# EAGLE design schema (EAGLE 6.5.0)
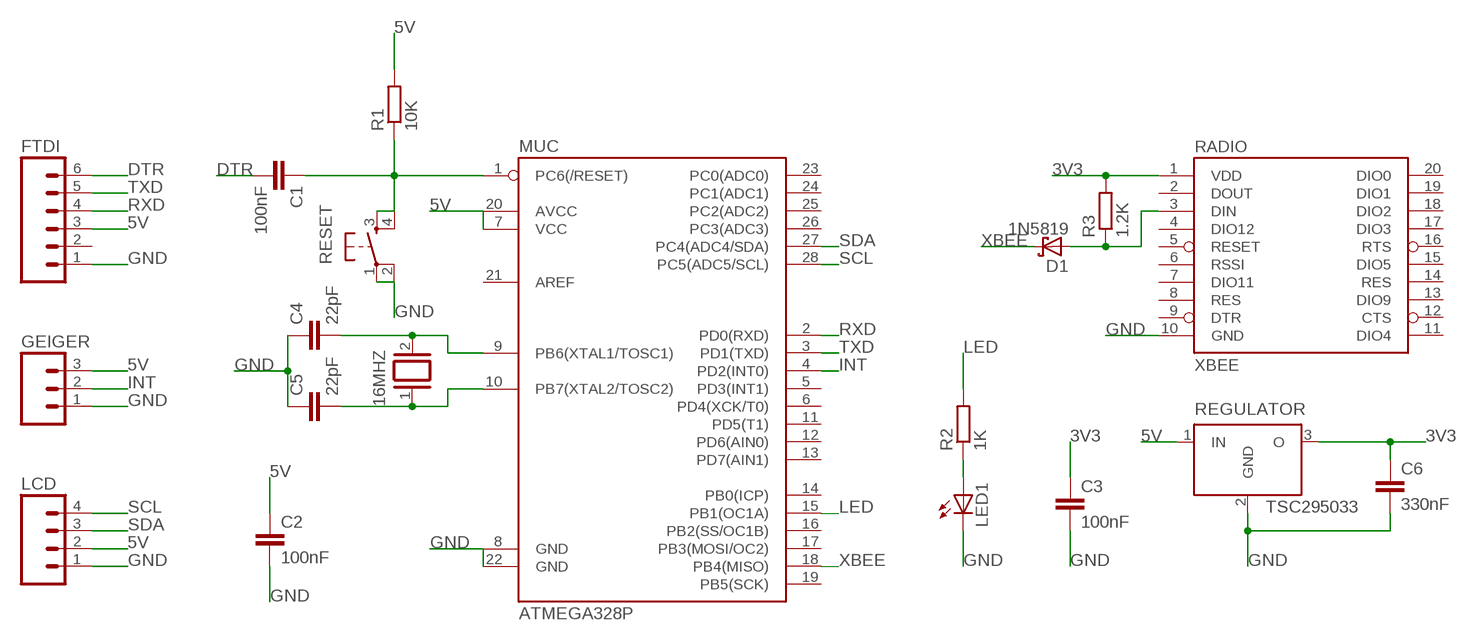
[diagram p0: schematic, sheet 1]

## Parts
16MHZ  XTAL/S  [QS]
C1  100nF  C-EU025-025X050  [C025-025X050]
C2  100nF  C-EU025-025X050  [C025-025X050]
C3  100nF  C-EU025-025X050  [C025-025X050]
C4  22pF  C-EU025-025X050  [C025-025X050]
C5  22pF  C-EU025-025X050  [C025-025X050]
C6  330nF  C-EU025-025X050  [C025-025X050]
D1  1N5819  1N5819-B  [DO41-7.6]
FTDI  M06SIP  [1X06]
GEIGER  M03PTH  [1X03]
LCD  M04PTH  [1X04]
LED1  LED3MM  [LED3MM]
MUC  ATMEGA328P  ATMEGA328P_PDIP  [DIL28-3]
R1  10K  R-EU_0207/10  [0207/10]
R2  1K  R-EU_0207/10  [0207/10]
R3  1.2K  R-EU_0207/10  [0207/10]
RADIO  XBEE  XBEE-1B1  [XBEE-1]
REGULATOR  TSC295033  LP2950Z  [TO92]
RESET  TAC_SWITCHPTH  [TACTILE-PTH]

## Nets
3V3: C3.1 C6.1 R3.2 RADIO.1(VDD) REGULATOR.3(O)
5V: C2.1 FTDI.3 GEIGER.3 LCD.2 MUC.7(VCC) MUC.20(AVCC) R1.2 REGULATOR.1(IN)
DTR: C1.2 FTDI.6
GND: C2.2 C3.2 C4.1 C5.1 C6.2 FTDI.1 GEIGER.1 LCD.1 LED1.K(C) MUC.8(GND) MUC.22(GND) RADIO.10(GND) REGULATOR.2(GND) RESET.1 RESET.2
INT: GEIGER.2 MUC.4(PD2(INT0))
LED: MUC.15(PB1(OC1A)) R2.2
N$1: C1.1 MUC.1(PC6(/RESET)) R1.1 RESET.3 RESET.4
N$2: 16MHZ.2 C4.2 MUC.9(PB6(XTAL1/TOSC1))
N$3: 16MHZ.1 C5.2 MUC.10(PB7(XTAL2/TOSC2))
N$4: D1.A R3.1 RADIO.3(DIN)
N$5: LED1.A R2.1
RXD: FTDI.4 MUC.2(PD0(RXD))
SCL: LCD.4 MUC.28(PC5(ADC5/SCL))
SDA: LCD.3 MUC.27(PC4(ADC4/SDA))
TXD: FTDI.5 MUC.3(PD1(TXD))
XBEE: D1.C MUC.18(PB4(MISO))
Unconnected: FTDI.2 MUC.5(PD3(INT1)) MUC.6(PD4(XCK/T0)) MUC.11(PD5(T1)) MUC.12(PD6(AIN0)) MUC.13(PD7(AIN1)) MUC.14(PB0(ICP)) MUC.16(PB2(SS/OC1B)) MUC.17(PB3(MOSI/OC2)) MUC.19(PB5(SCK)) MUC.21(AREF) MUC.23(PC0(ADC0)) MUC.24(PC1(ADC1)) MUC.25(PC2(ADC2)) MUC.26(PC3(ADC3)) RADIO.2(DOUT) RADIO.4(DIO12) RADIO.5(RESET) RADIO.6(RSSI) RADIO.7(DIO11) RADIO.8(RES) RADIO.9(DTR) RADIO.11(DIO4) RADIO.12(CTS) RADIO.13(DIO9) RADIO.14(RES) RADIO.15(DIO5) RADIO.16(RTS) RADIO.17(DIO3) RADIO.18(DIO2) RADIO.19(DIO1) RADIO.20(DIO0)

## Library data of the parts
16MHZ = special:XTAL/S: CRYSTAL
C1-C6 = rcl:C-EU: CAPACITOR, European symbol
D1 = diode:1N581*: 1.0A SCHOTTKY BARRIER RECTIFIER Source: http://www.diodes.com/datasheets/ds23001.pdf
FTDI = SparkFun-Connectors:M06: Header 6 Standard 6-pin 0.1" header. Use with straight break away headers (SKU : PRT-00116), right angle break away headers (PRT-00553), swiss pins (PRT-00743), machine pins (PRT-00117), and female headers (PRT-00115). Molex polarized connector foot print use with SKU : PRT-08094 with associated crimp pins and housings. NOTES ON THE VARIANTS LOCK and LOCK_LONGPADS... This footprint was designed to help hold the alignment of a through-hole component (i.e. 6-pin header) while soldering it into place. You may notice that each hole has been shifted either up or down by 0.005 of an inch from it's more standard position (which is a perfectly straight line). This slight alteration caused the pins (the squares in the middle) to touch the edges of the holes. Because they are alternating, it causes a "brace" to hold the component in place. 0.005 has proven to be the perfect amount of "off-center" position when using our standard breakaway headers. Although looks a little odd when you look at the bare footprint, once you have a header in there, the alteration is very hard to notice. Also, if you push a header all the way into place, it is covered up entirely on the bottom side. This idea of altering the position of holes to aid alignment will be further integrated into the Sparkfun Library for other footprints. It can help hold any component with 3 or more connection pins.
GEIGER = SparkFun-Connectors:M03: Header 3 Standard 3-pin 0.1" header. Use with straight break away headers (SKU : PRT-00116), right angle break away headers (PRT-00553), swiss pins (PRT-00743), machine pins (PRT-00117), and female headers (PRT-00115). Molex polarized connector foot print use with SKU : PRT-08232 with associated crimp pins and housings.
LCD = SparkFun-Connectors:M04: Header 4 Standard 4-pin 0.1" header. Use with straight break away headers (SKU : PRT-00116), right angle break away headers (PRT-00553), swiss pins (PRT-00743), machine pins (PRT-00117), and female headers (PRT-00115). Molex polarized connector foot print use with SKU : PRT-08231 with associated crimp pins and housings. 1MM SMD Version SKU: PRT-10208
LED1 = led:LED: LED OSRAM: - CHIPLED LG R971, LG N971, LY N971, LG Q971, LY Q971, LO R971, LY R971 LH N974, LH R974 LS Q976, LO Q976, LY Q976 LO Q996 - Hyper CHIPLED LW Q18S LB Q993, LB Q99A, LB R99A - SideLED LS A670, LO A670, LY A670, LG A670, LP A670 LB A673, LV A673, LT A673, LW A673 LH A674 LY A675 LS A676, LA A676, LO A676, LY A676, LW A676 LS A679, LY A679, LG A679 - Hyper Micro SIDELED® LS Y876, LA Y876, LO Y876, LY Y876 LT Y87S - SmartLED LW L88C, LW L88S LB L89C, LB L89S, LG L890 LS L89K, LO L89K, LY L89K LS L896, LA L896, LO L896, LY L896 - TOPLED LS T670, LO T670, LY T670, LG T670, LP T670 LSG T670, LSP T670, LSY T670, LOP T670, LYG T670 LG T671, LOG T671, LSG T671 LB T673, LV T673, LT T673, LW T673 LH T674 LS T676, LA T676, LO T676, LY T676, LB T676, LH T676, LSB T676, LW T676 LB T67C, LV T67C, LT T67C, LS T67K, LO T67K, LY T67K, LW E67C LS E67B, LA E67B, LO E67B, LY E67B, LB E67C, LV E67C, LT E67C LW T67C LS T679, LY T679, LG T679 LS T770, LO T770, LY T770, LG T770, LP T770 LB T773, LV T773, LT T773, LW T773 LH T774 LS E675, LA E675, LY E675, LS T675 LS T776, LA T776, LO T776, LY T776, LB T776 LHGB T686 LT T68C, LB T68C - Hyper Mini TOPLED® LB M676 - Mini TOPLED Santana® LG M470 LS M47K, LO M47K, LY M47K Source: http://www.osram.convergy.de LUXEON: - LUMILED® LXK2-PW12-R00, LXK2-PW12-S00, LXK2-PW14-U00, LXK2-PW14-V00 LXK2-PM12-R00, LXK2-PM12-S00, LXK2-PM14-U00 LXK2-PE12-Q00, LXK2-PE12-R00, LXK2-PE12-S00, LXK2-PE14-T00, LXK2-PE14-U00 LXK2-PB12-K00, LXK2-PB12-L00, LXK2-PB12-M00, LXK2-PB14-N00, LXK2-PB14-P00, LXK2-PB14-Q00 LXK2-PR12-L00, LXK2-PR12-M00, LXK2-PR14-Q00, LXK2-PR14-R00 LXK2-PD12-Q00, LXK2-PD12-R00, LXK2-PD12-S00 LXK2-PH12-R00, LXK2-PH12-S00 LXK2-PL12-P00, LXK2-PL12-Q00, LXK2-PL12-R00 Source: www.luxeon.com KINGBRIGHT: KA-3528ASYC Source: www.kingbright.com
MUC = SparkFun-DigitalIC:ATMEGA328P_PDIP: uC used in the Arduino 32kb flash, 1k EEPROM, 2k SRAM This is the through-hole version of this chip.
R1-R3 = resistor:R-EU_: RESISTOR, European symbol
RADIO = SparkFun-RF:XBEE-1: Xbee module footprints SMT header is CONN-09042.
REGULATOR = national-semiconductor:LP2950: Adjustable Micropower Voltage Regulator Source: http://www.national.com/ds/LP/LP2950.pdf; MF: NATIONAL SEMICONDUCTOR; MPN: LP2950CZ-5.0/NOPB; OC_FARNELL: 1150320; OC_NEWARK: 41K6545
RESET = SparkFun-Electromechanical:TAC_SWITCH: Momentary Switch Button commonly used for reset or general input. Spark Fun Electronics SKU : COM-00097

## Board
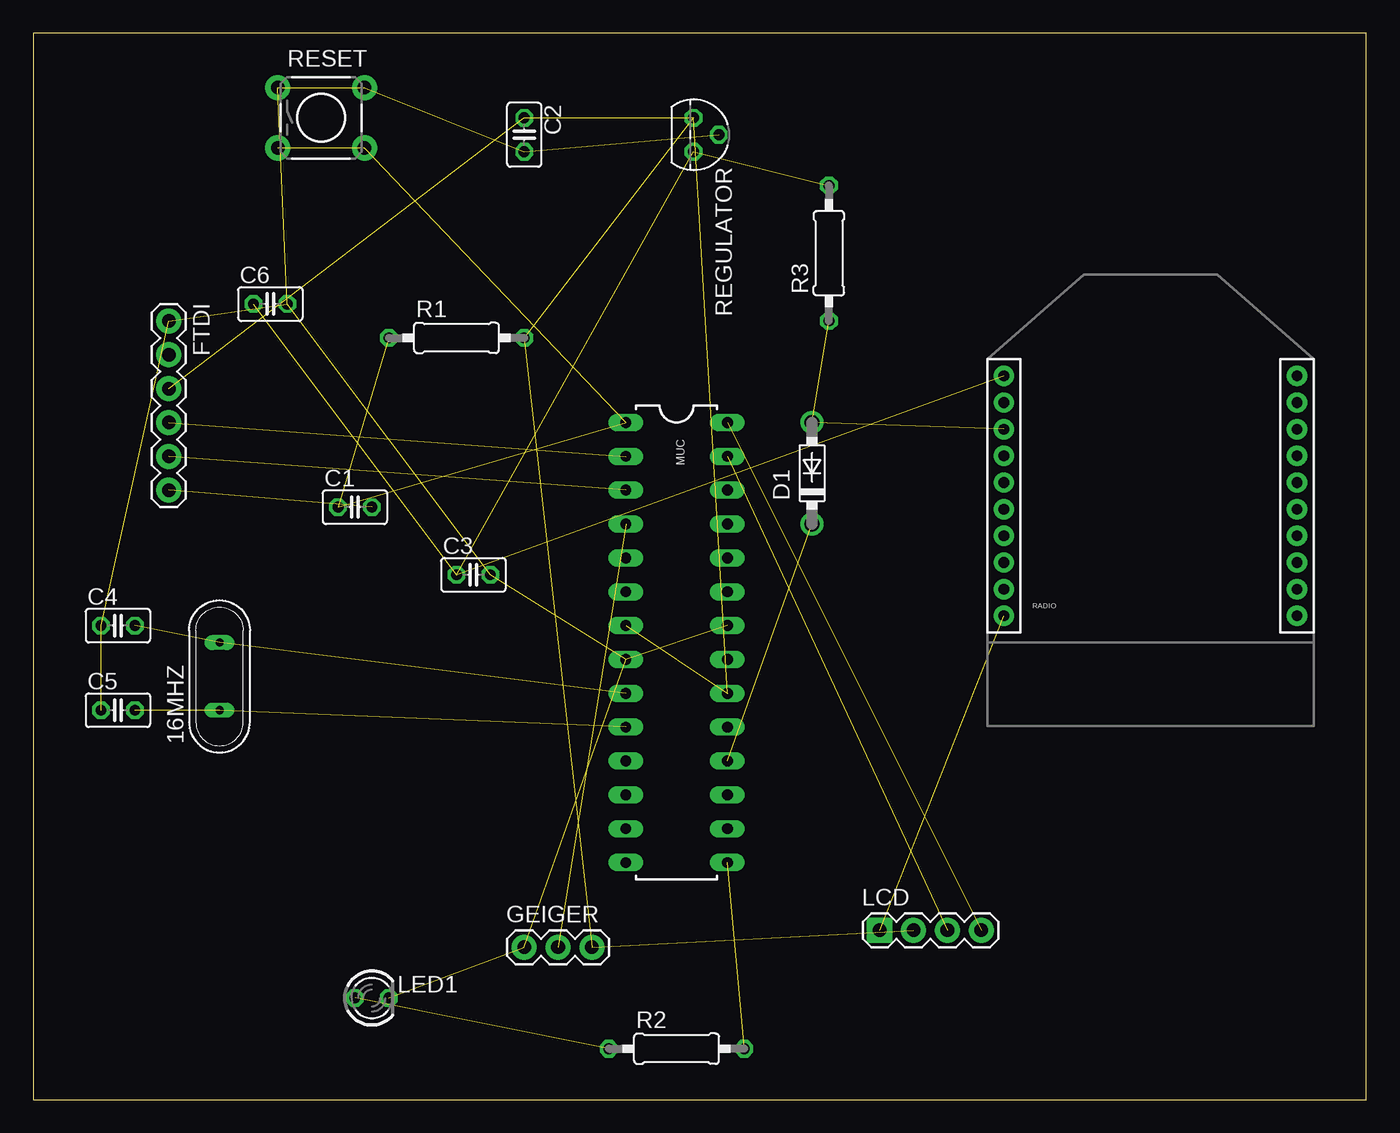
[diagram p1: board, top side]
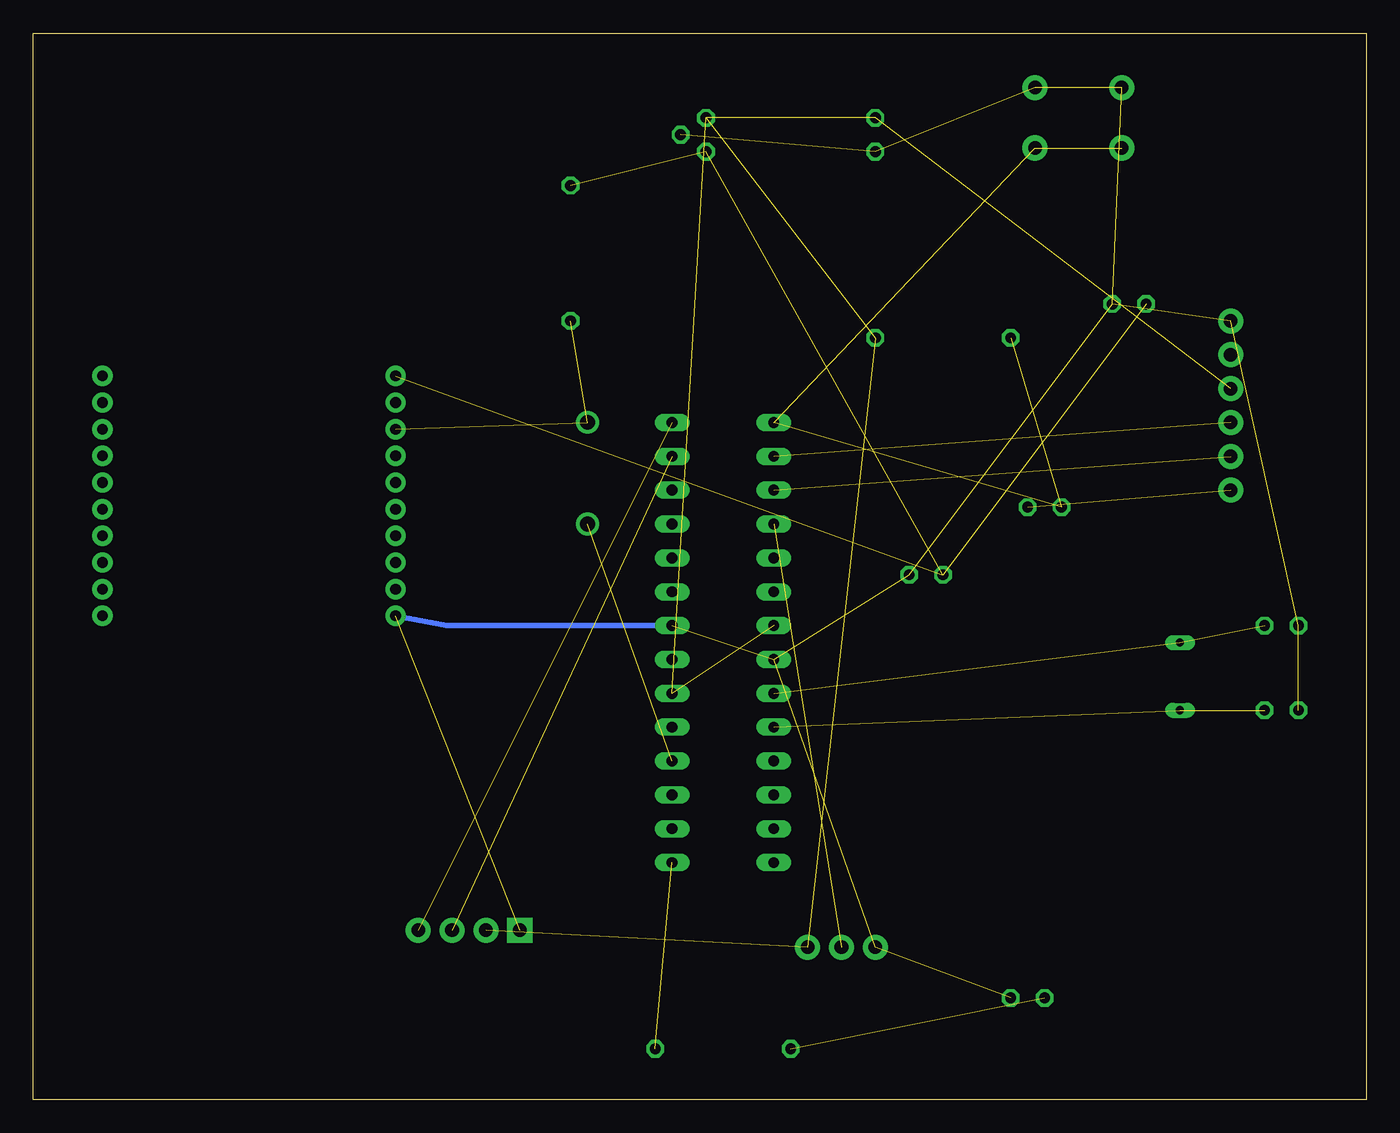
[diagram p2: board, bottom side, seen from below]

Size 100 x 80 mm. Coordinates in mm from the lower left corner, seen from the top.
Outline: 0,0 100,0 100,80 0,80 0,0
Copper layers (1*16): Top 0.035mm / dielectric 1.5mm / Bottom 0.035mm
Design rules "default": minimum track width 10mil, minimum drill 24mil, track to track 8mil, track to pad 8mil, pad to pad 8mil, via to via 8mil, smd to smd 8mil, copper to edge 40mil, drill to drill 8mil, minimum pad ring 10mil, minimum via ring 8mil, stop-mask expansion 4mil, vias tented up to drill 0mil, thermal gap 10mil

### Footprints (pad centres in the part's own frame; a part is rotated, then mirrored left to right if it is on the bottom)
QS = drill 0.61 long: 1 -2.54,0; 2 2.54,0
C025-025X050 = drill 0.813 octagon: 1 -1.27,0; 2 1.27,0
DO41-7.6 = drill 1.1 pad 1.7: A 3.81,0; C -3.81,0
1X06 = drill 1.016 pad 1.88: 1 0,0; 2 2.54,0; 3 5.08,0; 4 7.62,0; 5 10.16,0; 6 12.7,0
1X03 = drill 1.016 pad 1.88: 1 0,0; 2 2.54,0; 3 5.08,0
1X04 = drill 1.016 pad 1.88 square: 1 0,0 | drill 1.016 pad 1.88: 2 2.54,0; 3 5.08,0; 4 7.62,0
LED3MM = drill 0.813 octagon: A -1.27,0; K 1.27,0
DIL28-3 = drill 0.813 long: 1 -16.51,-3.81; 2 -13.97,-3.81; 3 -11.43,-3.81; 4 -8.89,-3.81; 5 -6.35,-3.81; 6 -3.81,-3.81; 7 -1.27,-3.81; 8 1.27,-3.81; 9 3.81,-3.81; 10 6.35,-3.81; 11 8.89,-3.81; 12 11.43,-3.81; 13 13.97,-3.81; 14 16.51,-3.81; 15 16.51,3.81; 16 13.97,3.81; 17 11.43,3.81; 18 8.89,3.81; 19 6.35,3.81; 20 3.81,3.81; 21 1.27,3.81; 22 -1.27,3.81; 23 -3.81,3.81; 24 -6.35,3.81; 25 -8.89,3.81; 26 -11.43,3.81; 27 -13.97,3.81; 28 -16.51,3.81
0207/10 = drill 0.813 octagon: 1 -5.08,0; 2 5.08,0
XBEE-1 = drill 0.8 pad 1.524: 1 -11,20; 2 -11,18; 3 -11,16; 4 -11,14; 5 -11,12; 6 -11,10; 7 -11,8; 8 -11,6; 9 -11,4; 10 -11,2; 11 11,2; 12 11,4; 13 11,6; 14 11,8; 15 11,10; 16 11,12; 17 11,14; 18 11,16; 19 11,18; 20 11,20
TO92 = drill 0.813 pad 1.27 octagon: 1 -1.27,0; 2 0,1.905; 3 1.27,0
TACTILE-PTH = drill 1.016 pad 1.88: 1 -3.251,2.261; 2 3.251,2.261; 3 -3.251,-2.261; 4 3.251,-2.261

### Placement (x,y rotation side)
16MHZ  13.97,31.75 90 top
C1  24.13,44.45 0 top
C2  36.83,72.39 270 top
C3  33.02,39.37 0 top
C4  6.35,35.56 0 top
C5  6.35,29.21 0 top
C6  17.78,59.69 0 top
D1  58.42,46.99 90 top
FTDI  10.16,58.42 270 top
GEIGER  36.83,11.43 0 top
LCD  63.5,12.7 0 top
LED1  25.4,7.62 0 top
MUC  48.26,34.29 270 top
R1  31.75,57.15 0 top
R2  48.26,3.81 0 top
R3  59.69,63.5 90 top
RADIO  83.82,34.29 0 top
REGULATOR  49.53,72.39 270 top
RESET  21.59,73.66 0 top

### Tracks (layer width: path | path; a pad name or v marks a point on that pad's centre or on a via)
3V3  (4 unrouted)
5V  (7 unrouted)
DTR  (1 unrouted)
GND  (13 unrouted)
  Bottom 0.406: MUC.22 69.01,35.56 RADIO.10
INT  (1 unrouted)
LED  (1 unrouted)
N$1  (4 unrouted)
N$2  (2 unrouted)
N$3  (2 unrouted)
N$4  (2 unrouted)
N$5  (1 unrouted)
RXD  (1 unrouted)
SCL  (1 unrouted)
SDA  (1 unrouted)
TXD  (1 unrouted)
XBEE  (1 unrouted)